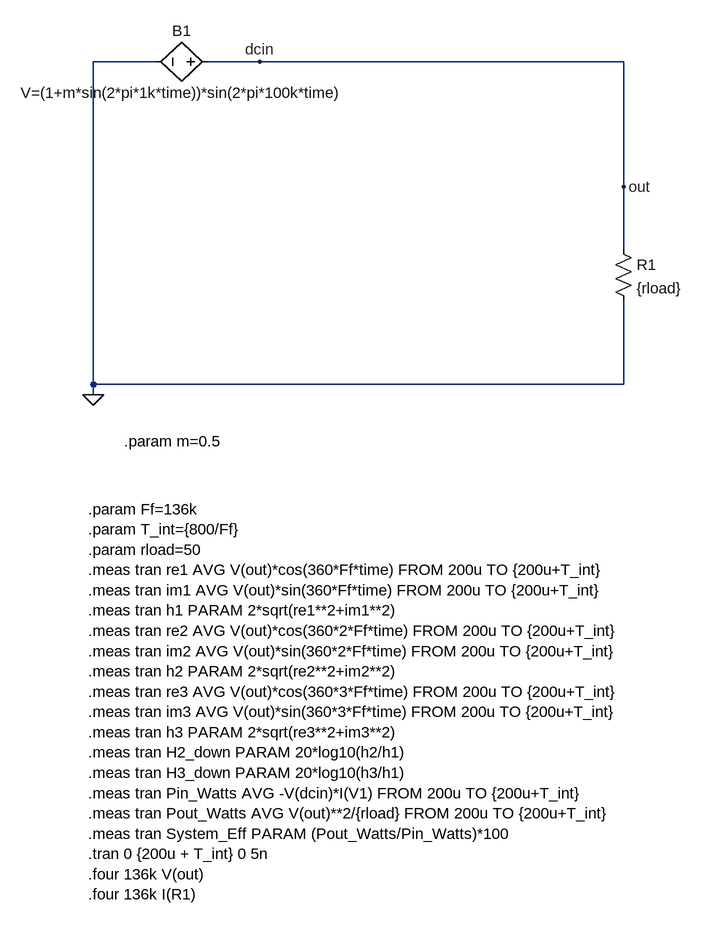
[diagram p0: schematic 136khz_sine_source_example.asc]
136khz_sine_source_example.asc, the LTspice schematic file:
Version 4.1
SHEET 1 2184 1392
WIRE -192 -272 -288 -272
WIRE -32 -272 -112 -272
WIRE 528 -272 -32 -272
WIRE 528 -80 528 -272
WIRE 528 16 528 -80
WIRE -288 224 -288 -272
WIRE 528 224 528 96
WIRE 528 224 -288 224
WIRE -288 240 -288 224
FLAG -288 240 0
FLAG 528 -80 out
FLAG -32 -272 dcin
SYMBOL res 512 0 R0
SYMATTR InstName R1
SYMATTR Value {rload}
SYMBOL bv -96 -272 R90
WINDOW 0 -32 56 VBottom 2
WINDOW 3 32 56 VTop 2
SYMATTR InstName B1
SYMATTR Value V=(1+m*sin(2*pi*1k*time))*sin(2*pi*100k*time)
TEXT -296 416 Left 2 !.param Ff=136k\n.param T_int={800/Ff}\n.param rload=50\n.meas tran re1 AVG V(out)*cos(360*Ff*time) FROM 200u TO {200u+T_int}\n.meas tran im1 AVG V(out)*sin(360*Ff*time) FROM 200u TO {200u+T_int}\n.meas tran h1 PARAM 2*sqrt(re1**2+im1**2)\n.meas tran re2 AVG V(out)*cos(360*2*Ff*time) FROM 200u TO {200u+T_int}\n.meas tran im2 AVG V(out)*sin(360*2*Ff*time) FROM 200u TO {200u+T_int}\n.meas tran h2 PARAM 2*sqrt(re2**2+im2**2)\n.meas tran re3 AVG V(out)*cos(360*3*Ff*time) FROM 200u TO {200u+T_int}\n.meas tran im3 AVG V(out)*sin(360*3*Ff*time) FROM 200u TO {200u+T_int}\n.meas tran h3 PARAM 2*sqrt(re3**2+im3**2)\n.meas tran H2_down PARAM 20*log10(h2/h1)\n.meas tran H3_down PARAM 20*log10(h3/h1)\n.meas tran Pin_Watts AVG -V(dcin)*I(V1) FROM 200u TO {200u+T_int}\n.meas tran Pout_Watts AVG V(out)**2/{rload} FROM 200u TO {200u+T_int}\n.meas tran System_Eff PARAM (Pout_Watts/Pin_Watts)*100\n.tran 0 {200u + T_int} 0 5n\n.four 136k V(out)\n.four 136k I(R1)
TEXT -240 312 Left 2 !.param m=0.5

The netlist it stands for:
* 136khz_sine_source_example.asc
R1 dcin 0 {rload}
B1 dcin 0 V=(1+m*sin(2*pi*1k*time))*sin(2*pi*100k*time)
.param Ff=136k
.param T_int={800/Ff}
.param rload=50
.meas tran re1 AVG V(out)*cos(360*Ff*time) FROM 200u TO {200u+T_int}
.meas tran im1 AVG V(out)*sin(360*Ff*time) FROM 200u TO {200u+T_int}
.meas tran h1 PARAM 2*sqrt(re1**2+im1**2)
.meas tran re2 AVG V(out)*cos(360*2*Ff*time) FROM 200u TO {200u+T_int}
.meas tran im2 AVG V(out)*sin(360*2*Ff*time) FROM 200u TO {200u+T_int}
.meas tran h2 PARAM 2*sqrt(re2**2+im2**2)
.meas tran re3 AVG V(out)*cos(360*3*Ff*time) FROM 200u TO {200u+T_int}
.meas tran im3 AVG V(out)*sin(360*3*Ff*time) FROM 200u TO {200u+T_int}
.meas tran h3 PARAM 2*sqrt(re3**2+im3**2)
.meas tran H2_down PARAM 20*log10(h2/h1)
.meas tran H3_down PARAM 20*log10(h3/h1)
.meas tran Pin_Watts AVG -V(dcin)*I(V1) FROM 200u TO {200u+T_int}
.meas tran Pout_Watts AVG V(out)**2/{rload} FROM 200u TO {200u+T_int}
.meas tran System_Eff PARAM (Pout_Watts/Pin_Watts)*100
.tran 0 {200u + T_int} 0 5n
.four 136k V(out)
.four 136k I(R1)
.param m=0.5
.backanno
.end